# EAGLE design sb3 (EAGLE 8.3.1)
COMPANY: ADAFRUIT INDUSTRIES; DRAWN: KTOWN; REV: B
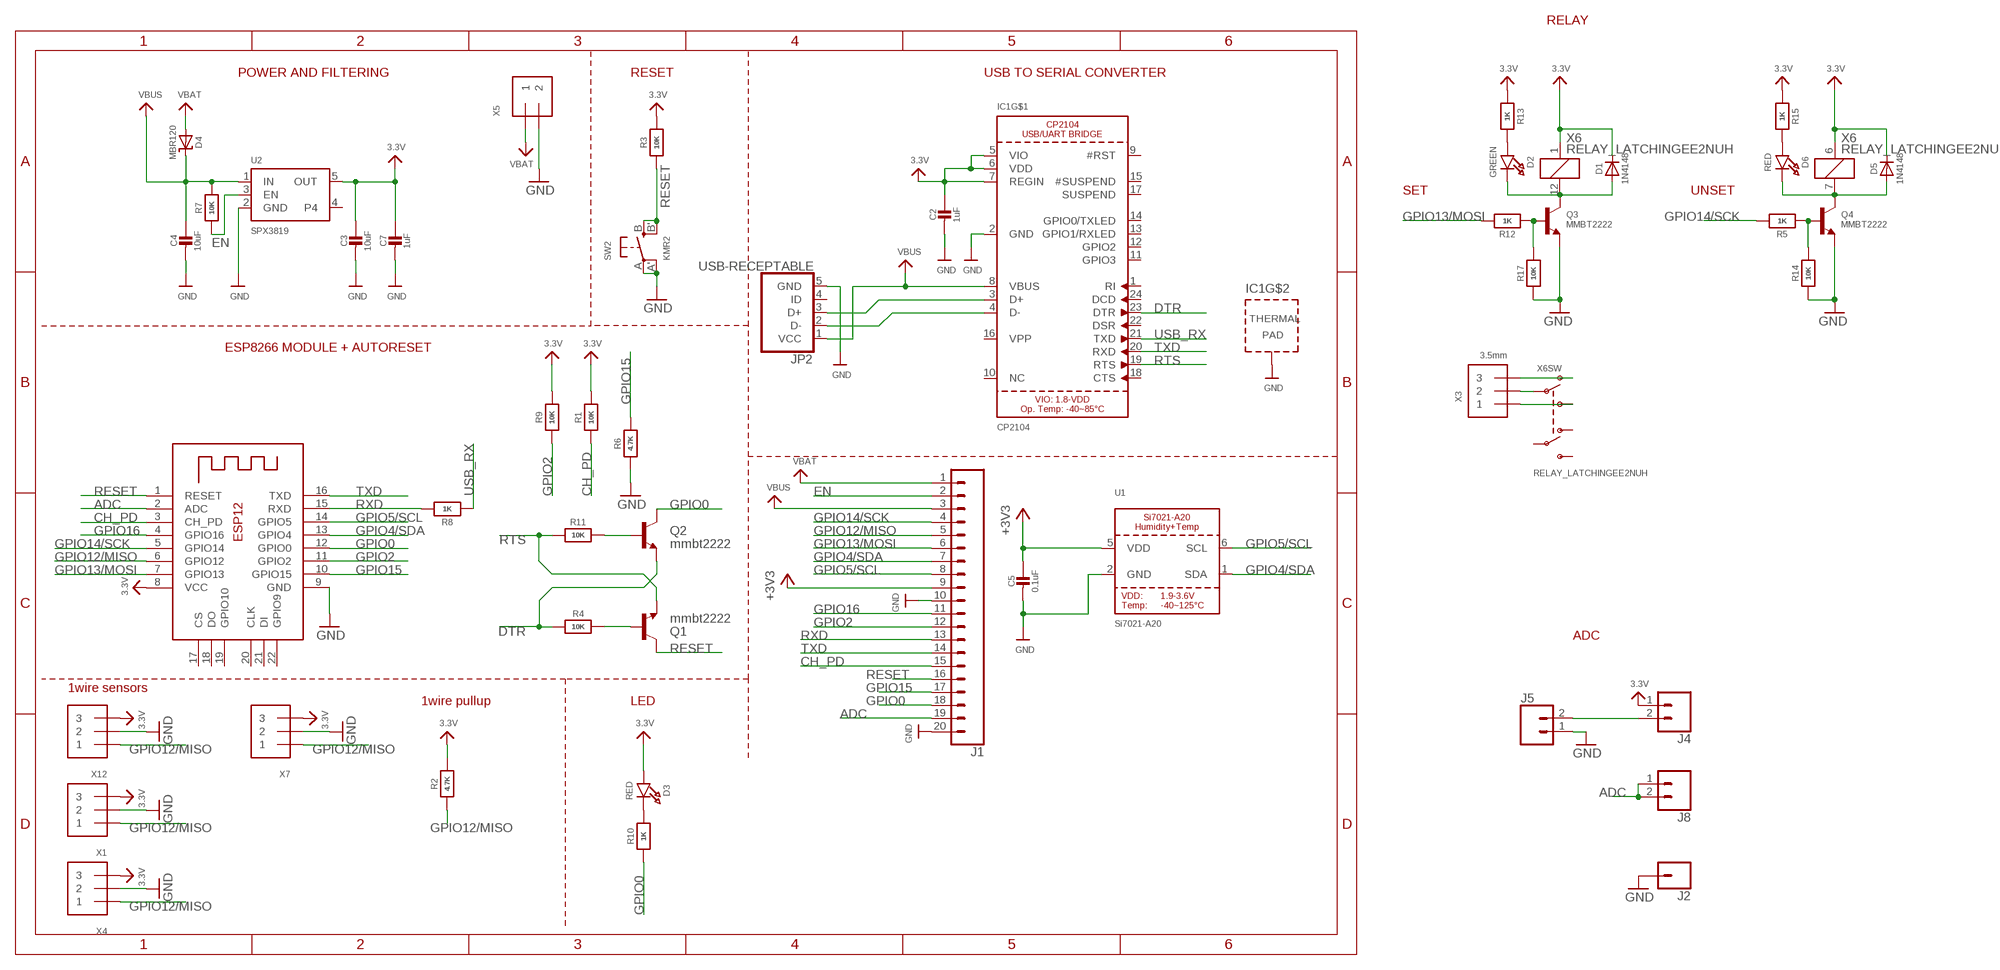
[diagram p0: schematic, sheet 1]

## Parts
C2  1uF  CAP_CERAMIC0603_NO  [0603-NO]
C3  10uF  CAP_CERAMIC0603_NO  [0603-NO]
C4  10uF  CAP_CERAMIC0603_NO  [0603-NO]
C5  0.1uF  CAP_CERAMIC0603_NO  [0603-NO]
C7  1uF  CAP_CERAMIC0603_NO  [0603-NO]
D1  1N4148  DIODESOD-323  [SOD-323]
D2  GREEN  LED0805_NOOUTLINE  [CHIPLED_0805_NOOUTLINE]
D3  RED  LED0805_NOOUTLINE  [CHIPLED_0805_NOOUTLINE]
D4  MBR120  DIODE-SCHOTTKYSOD-123  [SOD-123]
D5  1N4148  DIODESOD-323  [SOD-323]
D6  RED  LED0805_NOOUTLINE  [CHIPLED_0805_NOOUTLINE]
IC1  CP2104  [QFN24_4MM_SMSC]
J1  CONN_20  [1X20]
J2  CONN_01  [1X01]
J4  CONN_02  [1X02]
J5  CONN_023.5MM  [SCREWTERMINAL-3.5MM-2]
J8  CONN_02  [1X02]
JP2  USB-RECEPTABLE  [FCI-10103594-0001LF]
Q1  mmbt2222  TRANSISTOR_NPNSOT23-3  [SOT23-3]
Q2  mmbt2222  TRANSISTOR_NPNSOT23-3  [SOT23-3]
Q3  MMBT2222  TRANSISTOR_NPN  [SOT23-R]
Q4  MMBT2222  TRANSISTOR_NPN  [SOT23-R]
R1  10K  RESISTOR_0603_NOOUT  [0603-NO]
R2  4.7K  RESISTOR_0603_NOOUT  [0603-NO]
R3  10K  RESISTOR_0603_NOOUT  [0603-NO]
R4  10K  RESISTOR_0603_NOOUT  [0603-NO]
R5  1K  RESISTOR_0603_NOOUT  [0603-NO]
R6  4.7K  RESISTOR_0603_NOOUT  [0603-NO]
R7  10K  RESISTOR_0603_NOOUT  [0603-NO]
R8  1K  RESISTOR_0603_NOOUT  [0603-NO]
R9  10K  RESISTOR_0603_NOOUT  [0603-NO]
R10  1K  RESISTOR_0603_NOOUT  [0603-NO]
R11  10K  RESISTOR_0603_NOOUT  [0603-NO]
R12  1K  RESISTOR_0603_NOOUT  [0603-NO]
R13  1K  RESISTOR_0603_NOOUT  [0603-NO]
R14  10K  RESISTOR_0603_NOOUT  [0603-NO]
R15  1K  RESISTOR_0603_NOOUT  [0603-NO]
R17  10K  RESISTOR_0603_NOOUT  [0603-NO]
SW2  KMR2  SWITCH_TACT_SMT4.6X2.8  [BTN_KMR2_4.6X2.8]
U1  Si7021-A20  SI7021-A20  [DFN6_3X3_SI]
U2  SPX3819  VREG_SOT23-5  [SOT23-5]
X1  TERMBLOCK_1X3  [TERMBLOCK_1X3-3.5MM]
X2  ESP-12  ESP-12E  [ESP-12E]
X3  3.5mm  TERMBLOCK_1X3  [TERMBLOCK_1X3-3.5MM]
X4  TERMBLOCK_1X3  [TERMBLOCK_1X3-3.5MM]
X5  TERMBLOCK_1X2  [TERMBLOCK_1X2-3.5MM]
X6  RELAY_LATCHINGEE2NUH  [RELAY_EE2_LATCH]
X7  TERMBLOCK_1X3  [TERMBLOCK_1X3-3.5MM]
X12  TERMBLOCK_1X3  [TERMBLOCK_1X3-3.5MM]

## Nets
3.3V: C2.1 C3.1 C7.1 D1.C D3.A D5.C IC1.5(VIO) IC1.6(VDD) IC1.7(REGIN) J4.1 R1.2 R2.2 R3.2 R9.2 R13.1 R15.1 U2.5(OUT) X1.3 X2.8(VCC) X4.3 X6.1 X6.6 X7.3 X12.3
+3V3: C5.1 J1.9 U1.5(VDD)
ADC: J1.19 J8.1 J8.2 X2.2(ADC)
CH_PD: J1.15 R1.1 X2.3(CH_PD)
COM1 [HV]: X3.2 X6.9(SW:P1)
DTR: IC1.23(DTR) Q2.2(E) R4.1
EN: J1.2 R7.1 U2.3(EN)
GND: C2.2 C3.2 C4.2 C5.2 C7.2 IC1.2(GND) IC1.THERM(TP) J1.10 J1.20 J2.1 J5.1 JP2.5(GND) Q3.2(E) Q4.2(E) R6.1 R14.1 R17.1 SW2.A'(P1) SW2.A(P) U1.2(GND) U2.2(GND) X1.2 X2.9(GND) X4.2 X5.2 X7.2 X12.2
GPIO0: J1.18 Q2.3(C) R10.1 X2.12(GPIO0)
GPIO2: J1.12 R9.1 X2.11(GPIO2)
GPIO4/SDA: J1.7 U1.1(SDA) X2.13(GPIO4)
GPIO5/SCL: J1.8 U1.6(SCL) X2.14(GPIO5)
GPIO12/MISO: J1.5 R2.1 X1.1 X2.6(GPIO12) X4.1 X7.1 X12.1
GPIO13/MOSI: J1.6 R12.2 X2.7(GPIO13)
GPIO14/SCK: J1.4 R5.2 X2.5(GPIO14)
GPIO15: J1.17 R6.2 X2.10(GPIO15)
GPIO16: J1.11 X2.4(GPIO16)
N$1: D1.A D2.C Q3.3(C) X6.12
N$2: IC1.3(D+) JP2.3(D+)
N$3: J4.2 J5.2
N$4: D2.A R13.2
N$5: D3.C R10.2
N$6: IC1.4(D-) JP2.2(D-)
N$7: D6.A R15.2
N$12: Q1.1(B) R4.2
N$13: Q2.1(B) R11.2
N$22: Q3.1(B) R12.1 R17.2
N$25: D5.A D6.C Q4.3(C) X6.7
N$27: Q4.1(B) R5.1 R14.2
N$28 [HV]: X3.3 X6.10(SW:O1)
NO1 [HV]: X3.1 X6.8(SW:S1)
RESET: J1.16 Q1.3(C) R3.1 SW2.B'(S1) SW2.B(S) X2.1(RESET)
RTS: IC1.19(RTS) Q1.2(E) R11.1
RXD: J1.13 R8.2 X2.15(RXD)
TXD: IC1.20(RXD) J1.14 X2.16(TXD)
USB_RX: IC1.21(TXD) R8.1
VBAT: D4.A J1.1 X5.1
VBUS: C4.1 D4.C IC1.8(VBUS) J1.3 JP2.1(VCC) R7.2 U2.1(IN)
Unconnected: IC1.1(RI) IC1.9(#RST) IC1.10(NC) IC1.11(GPIO3) IC1.12(GPIO2) IC1.13(GPIO1/RXLED) IC1.14(GPIO0/TXLED) IC1.15(#SUSPEND) IC1.16(VPP) IC1.17(SUSPEND) IC1.18(CTS) IC1.22(DSR) IC1.24(DCD) JP2.4(ID) U2.4 X2.17(CS) X2.18(DO) X2.19(GPIO10) X2.20(CLK) X2.21(DI) X2.22(GPIO9) X6.3(SW:O2) X6.4(SW:P2) X6.5(SW:S2)

## Notes on the sheet
- RELAY
- POWER AND FILTERING | RESET | USB TO SERIAL CONVERTER
- SET | UNSET
- ESP8266 MODULE + AUTORESET
- ADC
- 1wire sensors
- 1wire pullup | LED

## Library data of the parts
C2-C5 C7 = microbuilder:CAP_CERAMIC: Ceramic Capacitors For new designs, use the packages preceded by an '_' character since they are more reliable: The following footprints should be used on most boards: _0402 - Standard footprint for regular board layouts _0603 - Standard footprint for regular board layouts _0805 - Standard footprint for regular board layouts _1206 - Standard footprint for regular board layouts For extremely tight-pitch boards where space is at a premium, the following 'micro-pitch' footprints can be used (smaller pads, no silkscreen outline, etc.): _0402MP - Micro-pitch footprint for very dense/compact boards _0603MP - Micro-pitch footprint for very dense/compact boards _0805MP - Micro-pitch footprint for very dense/compact boards _1206MP - Micro-pitch footprint for very dense/compact boards
D1 D5 = microbuilder:DIODE: Diode SMA Model Volts Amps Type Vf Ir Digikey # Notes SSA34-E3 40V 3A Schottky 480mV @ 3A 200uA @ 40V SSA34-E3/61TGITR-ND CDBA120-G 20V 1A Schottky 500mV @ 1A 500uA @ 20V 641-1014-6-ND REEL MBRA210 10V 2A Schottky 350mV @ 2A 700uA @ 10V MBRA210LT3 SOD-123 Model Volts Amps Type Vf Ir Order # Notes BAT54T1G 30V 200mA Schottky 800mV @ 200mA 2uA @ 25V BAT54T1GOSTR-ND B0530W 30V 500mA Schottky 430mV @ 500mA 130uA @ 30V B0530W-FDICT-ND REEL MBR120 20V 1A Schottky 340mV @ 1A MBR120VLSFT1GOSCT-ND SOD-323 Model Volts Amps Type Vf Ir Order # Notes PMEG2005EJ 20V 500mA Schottky 355mV @ 500mA 568-4110-1-ND ZLLS410 10V 570mA Schottky 380mV @ 570mA ZLLS410CT-ND 1N4148WS 75V 150mA Silicon/Simple 1V 1N4148WSFSCT-ND REEL SOD-523 Model Volts Amps Type Vf Ir Order # Notes BAT54XV2 30V 200mA Schottky 0.8V @ 100mA BAT54XV2CT-ND TB751S 30V 30mA Schottky RB751S-40TE61CT-ND SOT23-R/W (R = Solder Paste/Reflow Ovens, W = Hand-Soldering) Model Volts Amps Type Vf Ir Order # Notes BAT54FILM 40V 300mA Schottky 497-7162-1-ND POWERDI-5 Model Volts Amps Type Vf Ir Order # Notes PDS560 60V 5A Schottky 670mV @ 5A 150uA @ 60V PDS560DICT-ND
D2 D3 D6 = microbuilder:LED: LED 0603 - 0603 Surface Mount Package 2mA: Green LED - Low Power (3.9mcd, 2ma, 1.7Vf) - Digikey: 475-2709-2-ND Orange LED - Low Power (9.8mcd, 2ma, 1.8Vf) - Digikey: 475-1194-2-ND Red LED - Low Power (5mcd, 2ma, 1.8Vf) - Digikey: 475-1195-2-ND Yellow LED - Low Power (7mcd, 2ma, 1.8Vf) - Digikey: 475-1196-2-ND 5mA: Blue LED - Low Power (17mcd, 5ma, 2.9Vf) - Digikey: LNJ937W8CRACT-ND 0805 - 0805 Surface Mount Package 2mA: Red LED (8.8mcd, 2mA, 1.8Vf, Clear) - Low Power [Digikey: 475-2510-1-ND] Green LED (5mcd, 2mA, 1.8Vf, Clear) - Low Power [Digikey: 475-2730-1-ND] Yellow LED (11.3mcd, 2mA, 1.8Vf, Clear) - Low Power [Digikey: 475-2555-1-ND] 20mA: Red LED (104mcd, 20mA, Diffused) - LS R976 [Digikey: 475-1278-6-ND] Red LED (12mcd, 20mA, 2.0Vf, Clear) - APT2012EC [Digikey: 754-1128-1-ND] Green LED (15mcd, 20mA, 2.2Vf, Clear) - APT2012GC [Digikey: 754-1131-1-ND] Orange LED (160mcd, 20mA, 2.1Vf, Clear) - APT2012SECK [Digikey: 754-1130-1-ND] 1206 - 1206 Surface Mount Package Green LED (26mcd, 20mA, Diffused) - LG N971 [Digikey: 475-1407-6-ND] Red LED (15mcd, 20mA, Diffused) - LH N974 [Digikey: 475-1416-6-ND] Cree - Cree High-Power Surface Mount LEDs XPEBWT-L1-0000-00D50 - White 111lm 350mA 2.9Vf 6200K 110° XTEAWT-00-0000-00000LEE3 - White 114lm 350mA 2.85Vf 5000K 115° Everlight - Everlight 45-21 Series Surface Mount LEDs 45-21/QK2C-B2832AC2CB2/2T - Warm White 2000mcd 20mA 3.25Vf 3050K 120° 45-21/LK2C-B38452C4CB2/2T - Nuetral White 2000mcd 20mA 3.25Vf 4150K 120° 45-21/LK2C-B50634C6CB2/2T - Cold White 2200mcd 20mA 3.25Vf 5650K 120° PLCC2 Reverse Mount LS T77K-J1L2-1-0-2-R18-Z - Red 11.25mcd 2mA 1.8Vf 630nm 120° LO T77K-L1M2-24-Z - Orange 19.6mcd 2mA 1.8Vf 606nm 120° LY T77K-K2M1-26-Z - Yellow 15.7mcd 2mA 1.8Vf 587nm 120°
D4 = microbuilder:DIODE-SCHOTTKY
IC1 = microbuilder:CP2104: CP2104 - USB to UART Bridge VDD Output: 3.45V
J1 = SparkFun-Connectors:CONN_20: Multi connection point. Often used as Generic Header-pin footprint for 0.1 inch spaced/style header connections On any of the 0.1 inch spaced packages, you can populate with these: Break Away Headers - Straight <https://www.sparkfun.com/products/116> (PRT-00116) Break Away Male Headers - Right Angle <https://www.sparkfun.com/products/553> (PRT-00553) Female Headers <https://www.sparkfun.com/products/115> (PRT-00115) Break Away Headers - Machine Pin <https://www.sparkfun.com/products/117> (PRT-00117) Break Away Female Headers - Swiss Machine Pin <https://www.sparkfun.com/products/743> (PRT-00743) For SCREWTERMINALS and SPRING TERMINALS visit here: Screw Terimnals on SparkFun.com <https://www.sparkfun.com/search/results?term=Screw+Terminals> (5mm/3.5mm/2.54mm spacing) This device is also useful as a general connection point to wire up your design to another part of your project. Our various solder wires solder well into these plated through hole pads. Hook-Up Wire - Assortment (Stranded, 22 AWG) <https://www.sparkfun.com/products/11375> (PRT-11375) Hook-Up Wire - Assortment (Solid Core, 22 AWG) <https://www.sparkfun.com/products/11367> (PRT-11367) View the entire wire category on our website here <https://www.sparkfun.com/categories/141> Special notes: Molex polarized connector foot print use with SKU : PRT-08231 with associated crimp pins and housings. 1MM SMD Version SKU: PRT-10208 NOTES ON THE VARIANTS LOCK and LOCK_LONGPADS... This footprint was designed to help hold the alignment of a through-hole component (i.e. 6-pin header) while soldering it into place. You may notice that each hole has been shifted either up or down by 0.005 of an inch from it's more standard position (which is a perfectly straight line). This slight alteration caused the pins (the squares in the middle) to touch the edges of the holes. Because they are alternating, it causes a "brace" to hold the component in place. 0.005 has proven to be the perfect amount of "off-center" position when using our standard breakaway headers. Although looks a little odd when you look at the bare footprint, once you have a header in there, the alteration is very hard to notice. Also,if you push a header all the way into place, it is covered up entirely on the bottom side. Note about LOCK SPECIAL package: This is just like the LOCK variant in that the holes are staggared by 5 mil, but except for the last two holes. They are not altered from the "standard" footprint layout. This is used for a special purpose on the layout of our Graphic LCD Backpack. Make sure you want to use this device before selecting it for you project!
J2 = SparkFun-Connectors:CONN_01: Single connection point. Often used as Generic Header-pin footprint for 0.1 inch spaced/style header connections On any of the 0.1 inch spaced packages, you can populate with these: Break Away Headers - Straight <https://www.sparkfun.com/products/116> (PRT-00116) Break Away Male Headers - Right Angle <https://www.sparkfun.com/products/553> (PRT-00553) Female Headers <https://www.sparkfun.com/products/115> (PRT-00115) Break Away Headers - Machine Pin <https://www.sparkfun.com/products/117> (PRT-00117) Break Away Female Headers - Swiss Machine Pin <https://www.sparkfun.com/products/743> (PRT-00743) This device is also useful as a general connection point to wire up your design to another part of your project. Our various solder wires solder well into these plated through hole pads. Hook-Up Wire - Assortment (Stranded, 22 AWG) <https://www.sparkfun.com/products/11375> (PRT-11375) Hook-Up Wire - Assortment (Solid Core, 22 AWG) <https://www.sparkfun.com/products/11367> (PRT-11367) View the entire wire category on our website here <https://www.sparkfun.com/categories/141> Special notes: SMTSO-256-ET is a "flush mount" nut for a 4-40 screw. We mostly use this on specialty testbeds; it is a nice way to connect hardware to your PCB at an adjustable hieght. Also note, the SNAP packages are for using a snappable style connector. We sell a baggie of snaps and they are also used on two LilyPad designs: Snap Assortment - 30 pack (male and female) <https://www.sparkfun.com/products/11347> (DEV-11347) LilyPad Arduino SimpleSnap <https://www.sparkfun.com/products/10941> (DEV-10941) LilyPad SimpleSnap Protoboard <https://www.sparkfun.com/products/10940> (DEV-10940)
J4 J8 = SparkFun-Connectors:CONN_02: Multi connection point. Often used as Generic Header-pin footprint for 0.1 inch spaced/style header connections On any of the 0.1 inch spaced packages, you can populate with these: Break Away Headers - Straight <https://www.sparkfun.com/products/116> (PRT-00116) Break Away Male Headers - Right Angle <https://www.sparkfun.com/products/553> (PRT-00553) Female Headers <https://www.sparkfun.com/products/115> (PRT-00115) Break Away Headers - Machine Pin <https://www.sparkfun.com/products/117> (PRT-00117) Break Away Female Headers - Swiss Machine Pin <https://www.sparkfun.com/products/743> (PRT-00743) For SCREWTERMINALS and SPRING TERMINALS visit here: Screw Terimnals on SparkFun.com <https://www.sparkfun.com/search/results?term=Screw+Terminals> (5mm/3.5mm/2.54mm spacing) This device is also useful as a general connection point to wire up your design to another part of your project. Our various solder wires solder well into these plated through hole pads. Hook-Up Wire - Assortment (Stranded, 22 AWG) <https://www.sparkfun.com/products/11375> (PRT-11375) Hook-Up Wire - Assortment (Solid Core, 22 AWG) <https://www.sparkfun.com/products/11367> (PRT-11367) View the entire wire category on our website here <https://www.sparkfun.com/categories/141> Special notes: Molex polarized connector foot print use with: PRT-08233 with associated crimp pins and housings. 2.54_SCREWTERM for use with PRT-10571. 3.5mm Screw Terminal footprints for PRT-08084 5mm Screw Terminal footprints for use with PRT-08432
J5 = SparkFun-Connectors:CONN_02: Multi connection point. Often used as Generic Header-pin footprint for 0.1 inch spaced/style header connections On any of the 0.1 inch spaced packages, you can populate with these: Break Away Headers - Straight <https://www.sparkfun.com/products/116> (PRT-00116) Break Away Male Headers - Right Angle <https://www.sparkfun.com/products/553> (PRT-00553) Female Headers <https://www.sparkfun.com/products/115> (PRT-00115) Break Away Headers - Machine Pin <https://www.sparkfun.com/products/117> (PRT-00117) Break Away Female Headers - Swiss Machine Pin <https://www.sparkfun.com/products/743> (PRT-00743) For SCREWTERMINALS and SPRING TERMINALS visit here: Screw Terimnals on SparkFun.com <https://www.sparkfun.com/search/results?term=Screw+Terminals> (5mm/3.5mm/2.54mm spacing) This device is also useful as a general connection point to wire up your design to another part of your project. Our various solder wires solder well into these plated through hole pads. Hook-Up Wire - Assortment (Stranded, 22 AWG) <https://www.sparkfun.com/products/11375> (PRT-11375) Hook-Up Wire - Assortment (Solid Core, 22 AWG) <https://www.sparkfun.com/products/11367> (PRT-11367) View the entire wire category on our website here <https://www.sparkfun.com/categories/141> Special notes: Molex polarized connector foot print use with: PRT-08233 with associated crimp pins and housings. 2.54_SCREWTERM for use with PRT-10571. 3.5mm Screw Terminal footprints for PRT-08084 5mm Screw Terminal footprints for use with PRT-08432; PROD_ID: CONN-08399
JP2 = daspilker:USB-RECEPTABLE: USB Receptable
Q1 Q2 = SparkFun:TRANSISTOR_NPN: Transistor NPN BJT configuration in SOT23 package. MMBT2222 is the common NPN we use. Double check BCE configuration again layout.
Q3 Q4 = microbuilder:TRANSISTOR_NPN: NPN Transistor Transistor (NPN) 500mA 45V - BC817 [Digikey: 568-1631-1-ND] Transistor (NPN) 500mA 45V - BC817,215 [Mouser: 771-BC817-T/R] SOT23-R - SOT23 footprint optimised for use with solder paste and reflow ovens. SOT23-W - SOT23 footprint optimised for hand-soldering (larger pads).
R1-R15 R17 = microbuilder:RESISTOR: Resistors For new designs, use the packages preceded by an '_' character since they are more reliable: The following footprints should be used on most boards: _0402 - Standard footprint for regular board layouts _0603 - Standard footprint for regular board layouts _0805 - Standard footprint for regular board layouts _1206 - Standard footprint for regular board layouts For extremely tight-pitch boards where space is at a premium, the following 'micro-pitch' footprints can be used (smaller pads, no silkscreen outline, etc.): _0402MP - Micro-pitch footprint for very dense/compact boards _0603MP - Micro-pitch footprint for very dense/compact boards _0805MP - Micro-pitch footprint for very dense/compact boards _1206MP - Micro-pitch footprint for very dense/compact boards
SW2 = microbuilder:SWITCH_TACT_SMT: SMT Tact Switches 6x6mm - Digikey: P12940SCT-ND KMR2 (4.6x2.8mm) - Digikey: 401-1426-1-ND EVQ-PQHB55 - Light Touch, 160GF (4.5x4.5mm) - Digikey: P8090SCT-ND KMT0 - KMT021 NGJ LHS (etc.) IP68/Waterproof - Digikey: CKN10289CT-ND
U1 = microbuilder:SI7021-A20: Si7021-A20 - I2C Humidity and Temperature Sensor VDD: 1.9-3.6V Operating Temperature: -40~125°C +/-3% RH (max) 0..80% RH Humidity Sensor +/-0.4°C (max-, -10~85°C Temperature Sensor 150uA Active, 60nA Standby
U2 = microbuilder:VREG_SOT23-5: SOT23-5 Fixed Voltage Regulators Part Current Out V Out V In V Dropout θJA (°C/W) TJ (°C) Digikey Part No. ADP121 150mA 3.3V 3.4-5.5V 0.09V @ 150mA -- -- ADP121-AUJZ33R7CT-ND ADP121 150mA 3.0V 3.1-5.5V 0.09V @ 150mA -- -- ADP121-AUJZ30R7CT-ND ADP122 300mA 3.3V 3.4-5.5V 0.085V @ 300mA -- -- ADP122AUJZ-3.3-R7CT-ND ADP1712 300mA 3.3V 3.5-5.5V 0.17V @ 300mA -- -- ADP1712AUJZ-3.3-R7TR-ND AP7311 (Low Cost) 150mA 3.3V 3.5-6V 0.15V @ 150mA -- -- AP7311-33WG-7DICT-ND LD39015M18R 150mA 1.8V 1.9V-5.5V 0.08V @ 100mA -- -- 497-6977-1-ND LP2985A-33DBVR 150mA 3.3V 3.3-16V 0.28V @ 150mA 206 150 296-18479-1-ND MCP1824T-3302E/OT 300mA 3.3V 3.5V-6V 0.2V @ 300mA -- -- MCP1824T-3302E/OTCT-ND MIC5205-2.5YM5 TR 150mA 2.5V 2.7-16V 0.165V @ 150mA -- -- 576-1257-2-ND MIC5205-3.0YM5 TR 150mA 3.0V 3.2V-16V 0.165V @ 150mA -- -- 576-1258-2-ND MIC5205-3.3YM5 TR 150mA 3.3V 3.5V-16V 0.165V @ 150mA -- -- 576-1259-2-ND TPS780330220 150mA 3.3V+2.2V 3.6-5.5V 250mV Max -- -- 296-23332-1-ND TDA3663/N1,135 100mA 3.3V 3.5-45V 0.18V @ 50mA -- -- 568-5343-1-ND Max operating temp can be calculated using θJA, TJ (max junction temperature), and power in watts. Set the "Maximum Ambient Temperature" until it reaches TJ ("Max Junction Temperature"), which is the absolute limit for safe use of the regulator: Heat Sink Temperature Calculator <http://www.daycounter.com/Calculators/Heat-Sink-Temperature-Calculator.phtml> For example, With 12V source into a 3.3V LP2985 and a 30mA load, we are dissipating (12V-3.3V) * 0.03A = 0.261W. With a θJA of 206 °C/W, a TJ of 150°C, and 261mW we can safely use the chip without a heat sink up to 75°C (=147.1°C Junction Temperature).
X1 X3 X4 X7 X12 = microbuilder:TERMBLOCK_1X3: 3.5mm Terminal block http://www.ladyada.net/library/pcb/eaglelibrary.html
X2 = microbuilder:ESP-12E
X5 = microbuilder:TERMBLOCK_1X2: 3.5mm Terminal block http://www.ladyada.net/library/pcb/eaglelibrary.html
X6 = microbuilder:RELAY_LATCHING

## Net classes
1 HV: width 0.406 mm, drill 0.381 mm, clearance 1.016 mm

## Board
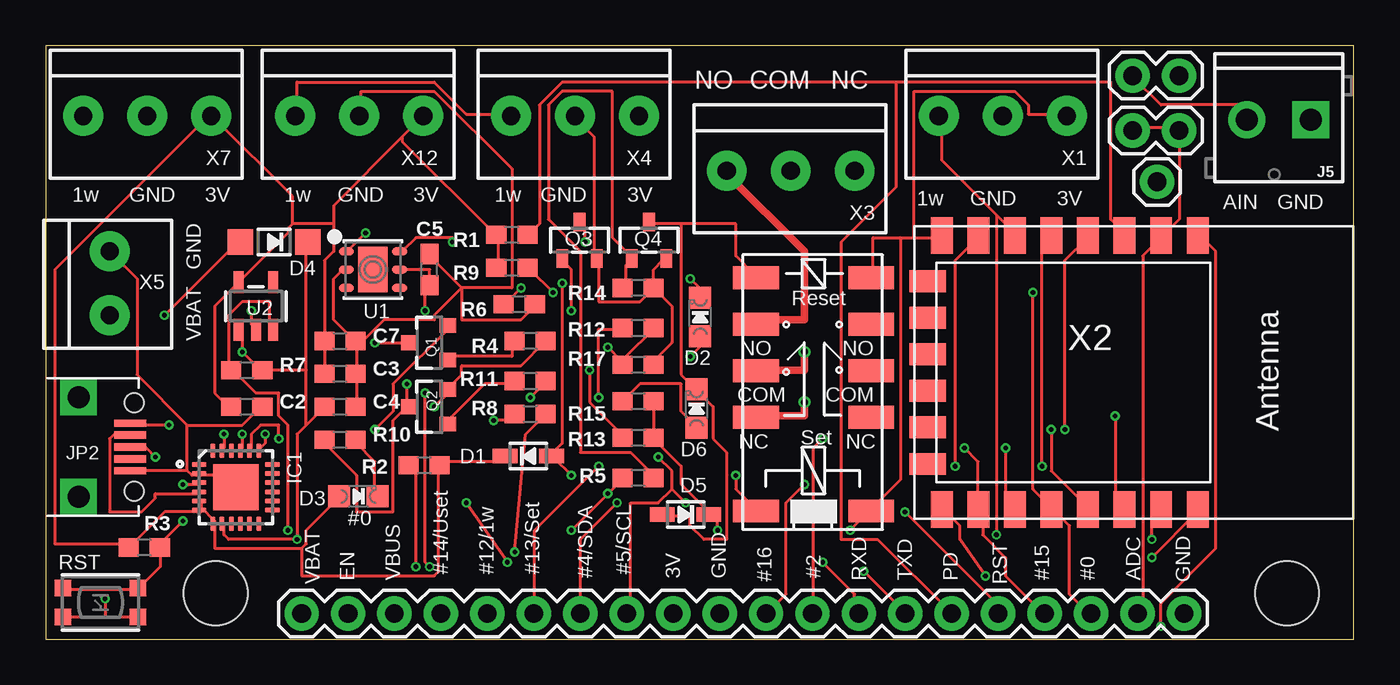
[diagram p1: board, top side]
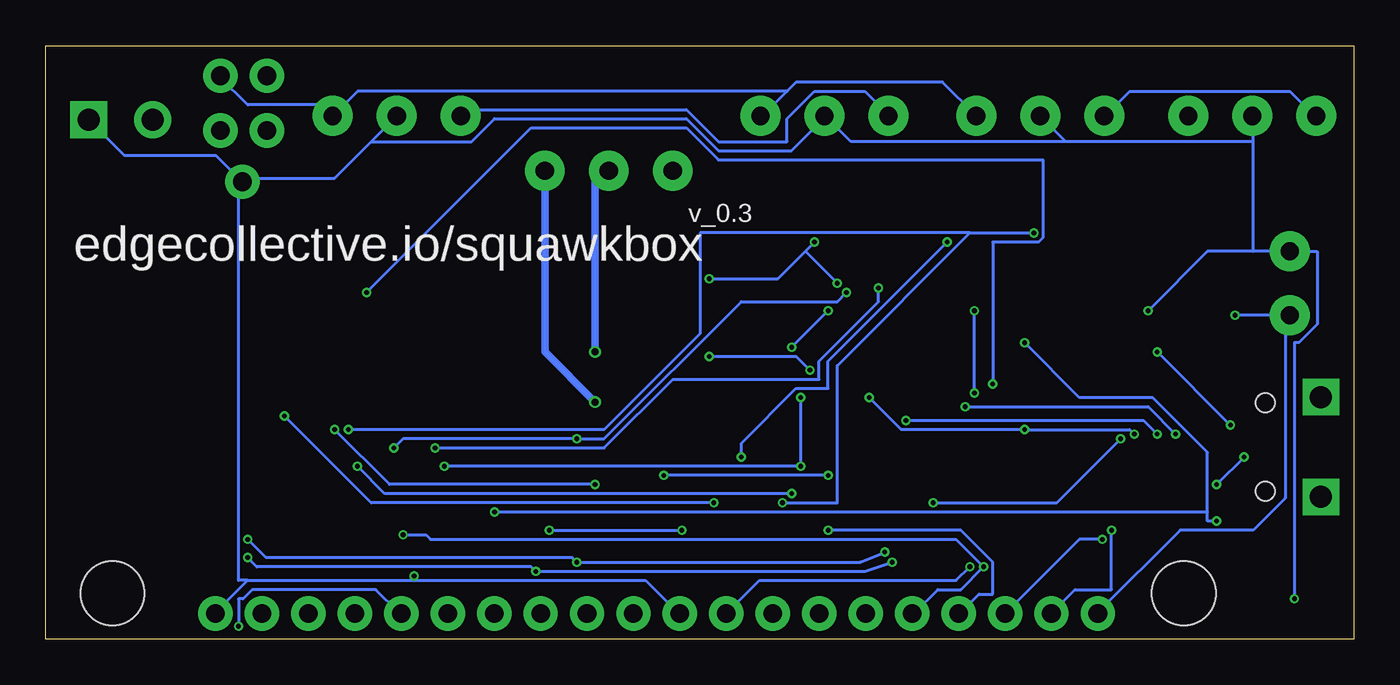
[diagram p2: board, bottom side, seen from below]

Size 71.55 x 32.44 mm. Coordinates in mm from the lower left corner, seen from the top.
Outline: 0,0 71.55,0 71.55,32.44 0,32.44 0,0
Copper layers (1*16): Top 0.035559375mm / dielectric 1.6mm / Bottom 0.035559375mm
Design rules "oshpark-2layer": minimum track width 6mil, minimum drill 10mil, track to track 6mil, track to pad 6mil, pad to pad 6mil, via to via 6mil, smd to smd 6mil, copper to edge 15mil, drill to drill 6mil, minimum pad ring 5mil, minimum via ring 5mil, stop-mask expansion 2.5mil, vias tented up to drill 0mil, thermal gap 10mil
Holes 3.5 mm at 9.3,2.5 67.9,2.5

### Footprints (pad centres in the part's own frame; a part is rotated, then mirrored left to right if it is on the bottom)
0603-NO = smd 1.1 x 1: 1 -0.85,0; 2 0.85,0
SOD-323 = smd 1.35 x 0.8: A 1.27,0; C -1.27,0
CHIPLED_0805_NOOUTLINE = smd 1.2 x 1.2: A 0,-1.05; C 0,1.05
SOD-123 = smd 1.4 x 1.4: A 1.85,0; C -1.85,0
QFN24_4MM_SMSC = smd 0.8 x 0.28: 1 -2,1.25; 2 -2,0.75; 3 -2,0.25; 4 -2,-0.25; 5 -2,-0.75; 6 -2,-1.25; 13 2,-1.25; 14 2,-0.75; 15 2,-0.25; 16 2,0.25; 17 2,0.75; 18 2,1.25 | smd 0.28 x 0.8: 7 -1.25,-2; 8 -0.75,-2; 9 -0.25,-2; 10 0.25,-2; 11 0.75,-2; 12 1.25,-2; 19 1.25,2; 20 0.75,2; 21 0.25,2; 22 -0.25,2; 23 -0.75,2; 24 -1.25,2 | smd 2.5 x 2.5: THERM 0,0
1X20 = drill 1.016 pad 1.88: 1 0,0; 2 2.54,0; 3 5.08,0; 4 7.62,0; 5 10.16,0; 6 12.7,0; 7 15.24,0; 8 17.78,0; 9 20.32,0; 10 22.86,0; 11 25.4,0; 12 27.94,0; 13 30.48,0; 14 33.02,0; 15 35.56,0; 16 38.1,0; 17 40.64,0; 18 43.18,0; 19 45.72,0; 20 48.26,0
1X01 = drill 1.016 pad 1.88: 1 0,0
1X02 = drill 1.016 pad 1.88: 1 0,0; 2 2.54,0
SCREWTERMINAL-3.5MM-2 = drill 1.2 pad 2.032 square: 1 0,0 | drill 1.2 pad 2.032: 2 3.5,0
FCI-10103594-0001LF = smd 0.4 x 1.75: 1 -1.3,4.525; 2 -0.65,4.525; 3 0,4.525; 4 0.65,4.525; 5 1.3,4.525 | drill 1.2 pad 2 square: P$3 -2.725,1.7; P$4 2.725,1.7 | hole 1.05: -2.425,4.73; 2.425,4.73
SOT23-3 = smd 0.8 x 0.9: 1 -0.95,-1; 2 0.95,-1; 3 0,1.1
SOT23-R = smd 0.635 x 1.016: 1 -0.95,-1; 2 0.95,-1; 3 0,1
BTN_KMR2_4.6X2.8 = smd 0.9 x 0.9: A 2.05,0.8; A' -2.05,0.8; B 2.05,-0.8; B' -2.05,-0.8
DFN6_3X3_SI = smd 0.85 x 0.45: 1 -1.45,1; 2 -1.45,0; 3 -1.45,-1; 4 1.45,-1; 5 1.45,0; 6 1.45,1 | smd 1.6 x 2.5: P$1 0,0
SOT23-5 = smd 0.55 x 1.2: 1 -0.95,-1.3; 2 0,-1.3; 3 0.95,-1.3; 4 0.95,1.3; 5 -0.95,1.3
TERMBLOCK_1X3-3.5MM = drill 1 pad 2.184: 1 3.55,0; 2 0.05,0; 3 -3.45,0
ESP-12E = smd 2 x 1.2: 1 -7.5,5.77; 2 -7.5,3.77; 3 -7.5,1.77; 4 -7.5,-0.23; 5 -7.5,-2.23; 6 -7.5,-4.23; 7 -7.5,-6.23; 8 -7.5,-8.23; 9 7.5,-8.23; 10 7.5,-6.23; 11 7.5,-4.23; 12 7.5,-2.23; 13 7.5,-0.23; 14 7.5,1.77; 15 7.5,3.77; 16 7.5,5.77 | smd 1.2 x 2: 17 -5,-9; 18 -3,-9; 19 -1,-9; 20 1,-9; 21 3,-9; 22 5,-9
TERMBLOCK_1X2-3.5MM = drill 1 pad 2.184: 1 1.8,0; 2 -1.7,0
RELAY_EE2_LATCH = smd 1.25 x 2.5: 1 -6.2,-3.15; 3 -1.07,-3.15; 4 1.47,-3.15; 5 4.01,-3.15; 6 6.55,-3.15; 7 6.55,3.15; 8 4.01,3.15; 9 1.47,3.15; 10 -1.07,3.15; 12 -6.2,3.15

### Placement (x,y rotation side)
C2  11,12.7 0 top
C3  16.1,14.5 0 top
C4  16.1,12.7 0 top
C5  21,20.2 90 top
C7  16.1,16.3 0 top
D1  26.4,10 0 top
D2  35.8,17.6 0 top
D3  17.1,7.8 270 top
D4  12.5,21.7 180 top
D5  35,6.8 180 top
D6  35.6,12.6 0 top
IC1  10.4,8.3 0 top
J1  14,1.4 0 top
J2  60.8,25 0 top
J4  62,30.8 180 top
J5  69.2,28.4 180 top
J8  62,27.8 180 top
JP2  0.1,10.5 270 top
Q1  21,16.2 90 top
Q2  21,12.7 90 top
Q3  29.2,21.8 0 top
Q4  33,21.8 0 top
R1  25.5,22.1 180 top
R2  20.7,9.5 0 top
R3  5.4,5 180 top
R4  26.5,16.3 180 top
R5  32.4,8.8 180 top
R6  25.9,18.3 180 top
R7  11,14.7 0 top
R8  26.5,12.3 0 top
R9  25.5,20.3 180 top
R10  16.1,10.9 0 top
R11  26.5,14.1 180 top
R12  32.4,17 180 top
R13  32.4,11 180 top
R14  32.4,19.2 180 top
R15  32.4,13 180 top
R17  32.4,15 180 top
SW2  3,2 180 top
U1  17.9,20.2 0 top
U2  11.5,18.2 0 top
X1  52.4,28.6 180 top
X2  57.24,14.57 270 top
X3  40.8,25.6 180 top
X4  29,28.6 180 top
X5  3.5,19.5 270 top
X6  42,13.2 90 top
X7  5.6,28.6 180 top
X12  17.2,28.6 180 top

### Tracks (layer width: path | path; a pad name or v marks a point on that pad's centre or on a via)
3.3V  (via drill 0.25)
  Top 0.152: R15.1 R13.1 33.25,10.95 34.75,9.45 34.75,8.45 36.25,6.95 D5.C 36.5,6.7 36.75,6.45 v36.75,5.95 | 46.75,21.95 45.25,21.95 45.25,19.95 X6.6 | 46.75,21.95 47.5,21.95 | 47.5,21.95 49,21.95 X2.8 | 46.75,21.95 46.75,8.7 45.25,7.2 X6.1 45,6.95 v44,5.95 | 47.5,21.95 47.5,29.95 53,29.95 53.75,29.2 53.75,28.7 55.75,28.7 X1.3 | D1.C 25,9.95 25,9.7 21.75,9.7 R2.2 21.5,9.45 21.5,3.7 21.25,3.45 14,3.45 14,4.95 | 8.5,7.2 8.5,7.45 IC1.5 | 8.5,7.2 8.5,6.95 IC1.6 8.25,6.95 6.5,6.95 R3.2 4.5,5.2 0.5,5.2 0.5,20.2 9,28.7 X7.3 9.25,28.45 13.5,24.2 13.5,22.7 | 8.5,7.2 9.25,6.45 IC1.7 9.25,6.2 9.25,4.95 14,4.95 | 14,4.95 14.25,5.2 14.25,5.95 16,7.7 D3.A | C2.1 10,12.7 9.25,13.45 9.25,18.2 10.5,19.45 U2.5 10.75,19.7 13.25,22.2 13.25,22.45 13.5,22.7 | R9.2 24.75,20.45 24.75,21.95 R1.2 24.5,22.2 19.5,27.2 19.5,27.45 | C3.1 C7.1 15.25,20.7 15.75,21.2 15.75,22.7 | 15.75,22.7 15.75,23.7 19.5,27.45 | X12.3 19.5,27.45 | 15.75,22.7 13.5,22.7
  Bottom 0.152: J4.1 62,30.7 60.5,29.2 56.5,29.2 56,28.7 X1.3 54.5,29.95 31,29.95 | v44,5.95 v36.75,5.95 | 31,29.95 30.5,30.45 22.5,30.45 X12.3 | 31,29.95 32.25,28.7 X4.3
+3V3  (via drill 0.25)
  Top 0.152: U1.5 21,20.2 C5.1 21,19.2 20.75,18.95 v20.75,17.95 | v20.75,13.45 20.75,4.2 v21,3.95
  Bottom 0.152: v20.75,13.45 v20.75,17.95 | v21,3.95 21.75,3.2 32.5,3.2 34.25,1.45 J1.9
ADC
  Top 0.152: J1.19 59.75,1.45 60,1.7 60,20.95 61,21.95 X2.2 61.25,22.2 62,22.95 J8.1 62,27.95 59.5,27.95 J8.2
CH_PD
  Top 0.152: 46.5,30.45 58.25,30.45 58.25,22.95 59,22.2 X2.3 | 46.5,30.45 28.25,30.45 27,29.2 27,22.7 26.5,22.2 R1.1 | 46.5,30.45 46.5,24.7 43.5,21.7 43.5,5.45 45.5,5.45 49.5,1.45 J1.15
COM1  (via drill 0.38)
  Top 0.406: v41.5,15.7 41.5,14.7 39,14.7 X6.9
  Bottom 0.406: v41.5,15.7 41.5,25.45 40.75,25.45 X3.2
DTR  (via drill 0.25)
  Top 0.152: v9.75,11.2 9.75,10.45 IC1.23 | v21.25,12.7 22,13.45 Q2.2 22,13.7 22.75,14.45 22.75,14.95 26,14.95 R4.1
  Bottom 0.152: v9.75,11.2 11.25,12.7 v21.25,12.7
EN  (via drill 0.25)
  Top 0.152: U2.3 12.25,16.95 12.25,18.45 10.75,18.45 10,17.7 10,14.7 R7.1 10.25,14.7 11.5,13.45 12.75,13.45 12.75,12.2 13.25,11.7 v13.25,5.95
  Bottom 0.152: v13.25,5.95 13.25,2.7 15.25,2.7 16.5,1.45 J1.2
GND  (via drill 0.25)
  Top 0.152: R14.1 33.25,20.2 33.75,20.7 Q4.2 | R14.1 34.25,18.2 34.25,16.2 33.25,15.2 R17.1 | X4.2 29,28.45 30,27.45 30,20.95 Q3.2 30.25,20.7 30.25,18.45 32.5,18.45 R14.1 | C4.2 17,12.7 17,14.45 C3.2 17,14.7 17,16.2 C7.2 | U1.2 16.25,20.2 15.75,19.7 15.75,17.45 16.75,16.45 C7.2 | 22.75,19.2 22.75,17.45 26,17.45 26.75,18.2 R6.1 | 22.75,19.2 21,20.95 C5.2 | 22.75,19.2 21.25,17.7 21.25,17.45 18.5,17.45 17.5,16.45 17,16.45 C7.2 | IC1.THERM 10.25,8.45 10.25,8.95 8.5,8.95 IC1.2 8.25,8.95 8,8.95 7.75,9.2 | 7.75,11.7 10.75,11.7 11.75,12.7 C2.2 | 7.75,9.2 7.75,11.7 | 7.75,9.2 JP2.5 | SW2.A' 3.25,1.2 | 3.25,1.2 SW2.A | v11.25,17.95 11.25,17.2 11.5,16.95 U2.2 | v3.25,2.2 3.25,1.2 | 7.75,11.7 5,14.45 5,19.7 X5.2 | 22.75,19.2 25.5,19.2 25.5,25.7 21.25,29.95 17.25,29.95 17.25,28.7 X12.2 | v51.4,3.45 50,5.45 50,6.2 49.25,6.95 X2.9
  Bottom 0.152: v11.25,17.95 8,21.2 5.5,21.2 | 5.5,21.2 X5.2 2,21.2 2,17.2 3,16.2 3.25,16.2 v3.25,2.2 | 5.5,21.2 5.5,27.2 | 5.5,27.2 5.5,28.45 X7.2 | 15.75,27.2 X12.2 | 5.5,27.2 15.75,27.2 | 15.75,27.2 27.5,27.2 28.75,28.45 X4.2 29,28.45 30.75,26.7 34.75,26.7 36.5,28.45 47,28.45 48.25,27.2 53.75,27.2 | J2.1 62.25,26.45 67.25,26.45 J5.1 | 53.75,27.2 55.75,25.2 60.75,25.2 J2.1 | 53.75,27.2 X1.2 | 51.65,3.2 v51.4,3.45 | 60.5,3.2 51.65,3.2 | 60.5,3.2 62.25,1.45 J1.20 | 51.65,3.2 38.75,3.2 37,1.45 J1.10 | 60.5,3.2 61,3.2 61,24.95 J2.1
GPIO0  (via drill 0.25)
  Top 0.152: 19.75,12.7 19,11.95 19,6.95 17,6.95 17,8.95 15.25,10.7 R10.1 | J1.18 57,1.45 56,2.45 56,6.2 55.25,6.95 X2.12 55,7.2 54,8.2 v54,18.95 | v19.75,13.95 19.75,12.7 | 19.75,12.7 Q2.3
  Bottom 0.152: v19.75,13.95 19.75,21.7 17.25,21.7 17,21.95 17,26.2 34.75,26.2 36.5,27.95 45,27.95 v54,18.95
GPIO2  (via drill 0.25)
  Top 0.152: v27.75,18.95 26.5,20.2 R9.1 | v42.5,10.95 42,10.45 42,1.45 J1.12 | v52.5,10.45 52.5,7.7 53,7.2 X2.11
  Bottom 0.152: v27.75,18.95 28.25,18.45 33.5,18.45 41,10.95 v42.5,10.95 52,10.95 v52.5,10.45
GPIO4/SDA  (via drill 0.25)
  Top 0.152: v17.5,22.2 16.5,21.2 U1.1 | v31.25,7.45 29.25,5.45 29.25,1.45 J1.7 | v55,11.45 55,9.2 57,7.2 X2.13
  Bottom 0.152: 21,22.2 v17.5,22.2 | 21,22.2 28.25,14.95 28.25,7.45 v31.25,7.45 | v55,11.45 41,11.45 35.75,16.7 35.75,22.2 21,22.2
GPIO5/SCL  (via drill 0.25)
  Top 0.152: v22.25,21.7 22.25,21.95 20.25,21.95 19.5,21.2 U1.6 | v33.5,9.95 34.25,9.2 34.25,8.2 | 34.25,8.2 33.5,7.45 32,7.45 32,1.45 J1.8 | v58.5,12.2 58.5,7.7 59,7.2 X2.14 | 34.25,8.2 v35,7.45
  Bottom 0.152: v22.25,21.7 28.75,15.2 28.75,13.7 30.5,13.7 33.5,10.7 v33.5,9.95 | v58.5,12.2 53.75,7.45 v35,7.45
GPIO12/MISO  (via drill 0.25)
  Top 0.152: X4.1 25.25,28.7 23,28.7 21.25,30.45 13.75,30.45 13.75,28.7 X12.1 | v20.25,3.95 20.25,9.2 20,9.45 R2.1 | 52,23.2 49,26.2 49,28.45 X1.1 | 52,23.2 53,22.2 X2.6 | 52,23.2 v52,5.7
  Bottom 0.152: X7.1 2.25,28.7 3.5,29.95 12.25,29.95 13.5,28.7 X12.1 | J1.5 24,1.45 22.75,2.7 21.5,2.7 v20.25,3.95 21.75,5.45 50.5,5.45 50.75,5.7 v52,5.7 | X1.1 48.5,28.95 36.5,28.95 34.75,27.2 31,27.2 31,28.45 29.5,29.95 26.75,29.95 25.5,28.7 X4.1
GPIO13/MOSI  (via drill 0.25)
  Top 0.152: v30.25,13.2 30.25,16.95 31.5,16.95 R12.2 | v30.25,9.45 26.75,5.95 26.75,1.45 J1.6 | v49.75,9.45 49.75,20.7 51,21.95 X2.7
  Bottom 0.152: v30.25,13.2 v30.25,9.45 v49.75,9.45
GPIO14/SCK  (via drill 0.25)
  Top 0.152: v28.75,5.95 v30.75,7.95 31.5,8.7 R5.2 | v54.5,9.45 54.5,21.45 55,21.95 X2.5
  Bottom 0.152: v28.75,5.95 21.5,5.95 19.75,4.2 19.75,2.45 20.5,2.45 21.5,1.45 J1.4 | v54.5,9.45 53,7.95 v30.75,7.95
GPIO15  (via drill 0.25)
  Top 0.152: v26,19.2 25.25,18.45 R6.2 | v50.25,10.45 51,9.7 51,7.2 X2.10 51.25,6.95 51.25,5.7 52.5,4.45 52.5,3.45 54.5,1.45 J1.17
  Bottom 0.152: v26,19.2 26,18.45 29.25,15.2 29.25,14.2 37.25,14.2 41,10.45 v50.25,10.45
GPIO16  (via drill 0.25)
  Top 0.152: v55.75,11.45 55.75,20.7 57,21.95 X2.4 | v41.5,8.45 40.5,7.45 40.5,2.45 39.5,1.45 J1.11
  Bottom 0.152: v55.75,11.45 52.75,8.45 v41.5,8.45
N$1  (via drill 0.25)
  Top 0.152: v29.5,21.7 29.5,22.45 29.25,22.7 Q3.3 | v35.25,19.7 35.75,19.2 35.75,18.7 D2.C | v28.25,19.45 28.25,10.7 27.75,10.2 D1.A 27.75,9.95 v28.75,8.95 | v37.75,8.95 37.75,8.2 38.75,7.2 X6.12
  Bottom 0.152: 30,21.2 31.5,19.7 v35.25,19.7 | 30,21.2 v29.5,21.7 | 30,21.2 v28.25,19.45 | v28.75,8.95 v37.75,8.95
N$2  (via drill 0.25)
  Top 0.152: v7.5,8.45 8.25,8.45 IC1.3 | v6,9.95 5.5,10.45 4.75,10.45 JP2.3
  Bottom 0.152: v6,9.95 v7.5,8.45
N$3
  Top 0.152: J4.2 59.5,30.7 61,29.2 65.5,29.2 65.5,28.45 J5.2
N$4  (via drill 0.25)
  Top 0.152: v29.75,14.7 29.75,12.95 31.5,11.2 R13.2 | v35.25,15.45 35.75,15.95 35.75,16.45 D2.A
  Bottom 0.152: v29.75,14.7 30.5,15.45 v35.25,15.45
N$5
  Top 0.152: R10.2 17,10.7 18,9.7 18,7.95 D3.C
N$6
  Top 0.152: IC1.4 8.25,7.95 6,7.95 6,7.7 5.25,6.95 3.5,6.95 3.5,10.95 3.75,11.2 4.5,11.2 JP2.2
N$7
  Top 0.152: R15.2 32.5,13.95 34.75,13.95 34.75,12.45 35.5,11.7 D6.A
N$12
  Top 0.152: Q1.1 22,15.45 25.5,15.45 25.5,16.2 R4.2
N$13
  Top 0.152: Q2.1 22,11.95 24,13.95 25.5,13.95 R11.2
N$22  (via drill 0.25)
  Top 0.152: v28.75,17.95 28.75,20.2 28.25,20.7 Q3.1 | v30.75,15.95 31.5,15.2 R17.2 31.75,15.2 31.75,15.45 33.25,16.95 R12.1
  Bottom 0.152: v30.75,15.95 v28.75,17.95
N$25
  Top 0.152: 34.75,22.7 37.75,22.7 37.75,20.95 38.75,19.95 X6.7 | 34.75,22.7 33,22.7 Q4.3 | 34.75,22.7 34.75,14.45 35.5,13.7 D6.C 35.75,13.45 36.5,12.7 36.5,10.95 37.25,10.2 37.25,5.45 36,5.45 35.25,6.2 35.25,6.7 33.75,6.7 D5.A
N$27
  Top 0.152: R14.2 31.75,19.2 31.75,20.45 32,20.7 Q4.1 32,20.95 31,21.95 31,29.95 28.25,29.95 27.5,29.2 27.5,22.95 29.25,21.2 29.25,10.2 32,10.2 33.25,8.95 R5.1
N$28  (via drill 0.38)
  Top 0.406: v41.5,12.95 41.5,12.2 39,12.2 X6.10
  Bottom 0.406: v41.5,12.95 44.25,15.7 X3.3
NO1
  Top 0.406: X6.8 39,17.45 41.5,17.45 41.5,21.2 37.25,25.45 X3.1
RESET  (via drill 0.25)
  Top 0.152: SW2.B 1,2.7 5,2.7 SW2.B' 5.25,2.95 6.25,3.95 R3.1 6.25,5.2 v7.5,6.45 | v18,16.2 Q1.3 | v61,0.7 61,1.95 64,4.95 64,21.2 63.25,21.95 X2.1 | v47,6.95 52,1.95 52,1.45 J1.16
  Bottom 0.152: v18,16.2 15,13.2 11,13.2 8,10.2 8,6.95 | 8,6.95 8,6.45 v7.5,6.45 | v61,0.7 61,2.2 60.75,2.2 60.25,2.7 53.5,2.7 52.25,1.45 J1.16 | v47,6.95 8,6.95
RTS  (via drill 0.25)
  Top 0.152: v12,11.2 12,10.7 11.75,10.45 IC1.19 | v18,11.45 19,12.45 19,13.95 22,16.95 Q1.2 | v26.5,13.2 27.25,13.95 R11.1
  Bottom 0.152: v12,11.2 12.25,11.45 v18,11.45 24.75,11.45 v26.5,13.2
RXD  (via drill 0.25)
  Top 0.152: R8.2 26.25,11.2 v25.65,4.75 | v42.5,4.2 44.25,2.45 44.25,1.45 J1.13 | v60.5,5.45 60.5,6.45 61,6.95 X2.15
  Bottom 0.152: v25.65,4.75 27,4.2 v42.5,4.2 42.75,4.45 59.5,4.45 v60.5,5.45
TXD  (via drill 0.25)
  Top 0.152: v12.75,10.95 12.75,11.7 11.75,11.7 11.25,11.2 11.25,10.45 IC1.20 | v25.25,4.2 v23,7.45 | v44.75,3.7 47,1.45 J1.14 | v60.5,4.45 63,6.95 X2.16
  Bottom 0.152: v12.75,10.95 16.25,7.45 v23,7.45 | v25.25,4.2 26.75,3.7 v44.75,3.7 45,3.95 60,3.95 v60.5,4.45
USB_RX  (via drill 0.25)
  Top 0.152: v10.75,11.2 10.75,10.45 IC1.21 | v24.5,11.95 25.5,11.95 25.5,12.2 R8.1
  Bottom 0.152: v10.75,11.2 11.5,11.95 v24.5,11.95
VBAT  (via drill 0.25)
  Top 0.152: v6.5,17.7 10.5,21.7 D4.A
  Bottom 0.152: 3.75,17.7 v6.5,17.7 | 3.75,17.7 3.75,7.7 5.5,5.95 9.5,5.95 14,1.45 J1.1 | 3.75,17.7 X5.1
VBUS  (via drill 0.25)
  Top 0.152: U2.1 10.75,16.7 v10.75,15.7 11.75,14.7 R7.2 14.25,14.7 | v6.75,11.7 4.75,11.7 JP2.1 | C4.1 14.25,11.7 | 14.25,11.7 13.75,11.2 v13.75,5.45 10,5.45 9.75,5.7 9.75,6.2 IC1.8 | 14.25,11.7 14.25,14.7 | 14.25,14.7 14.25,21.7 D4.C
  Bottom 0.152: v10.75,15.7 v6.75,11.7 | v13.75,5.45 15,5.45 19,1.45 J1.3

### Text on the board
tPlace: NO | COM | NC | 1w | GND | 3V | 1w | GND | 3V | 1w | GND | 3V | 1w | GND | 3V | AIN | GND | GND | VBAT | D3 | #0 | RST | VBAT | EN | VBUS | #14/Uset | #12/1w | #13/Set | #4/SDA | #5/SCL | 3V | GND | #16 | #2 | RXD | TXD | PD | RST | #15 | #0 | ADC | GND
bPlace: v_0.3 | edgecollective.io/squawkbox